# Altium schematic sheet LedMatrix_TestWithSingleDigit.SchDoc
size A4; Organization: Altium Limited; Address1: L3, 12a Rodborough Rd; Address2: Frenchs Forest; Address3: NSW; Address4: Australia 2086
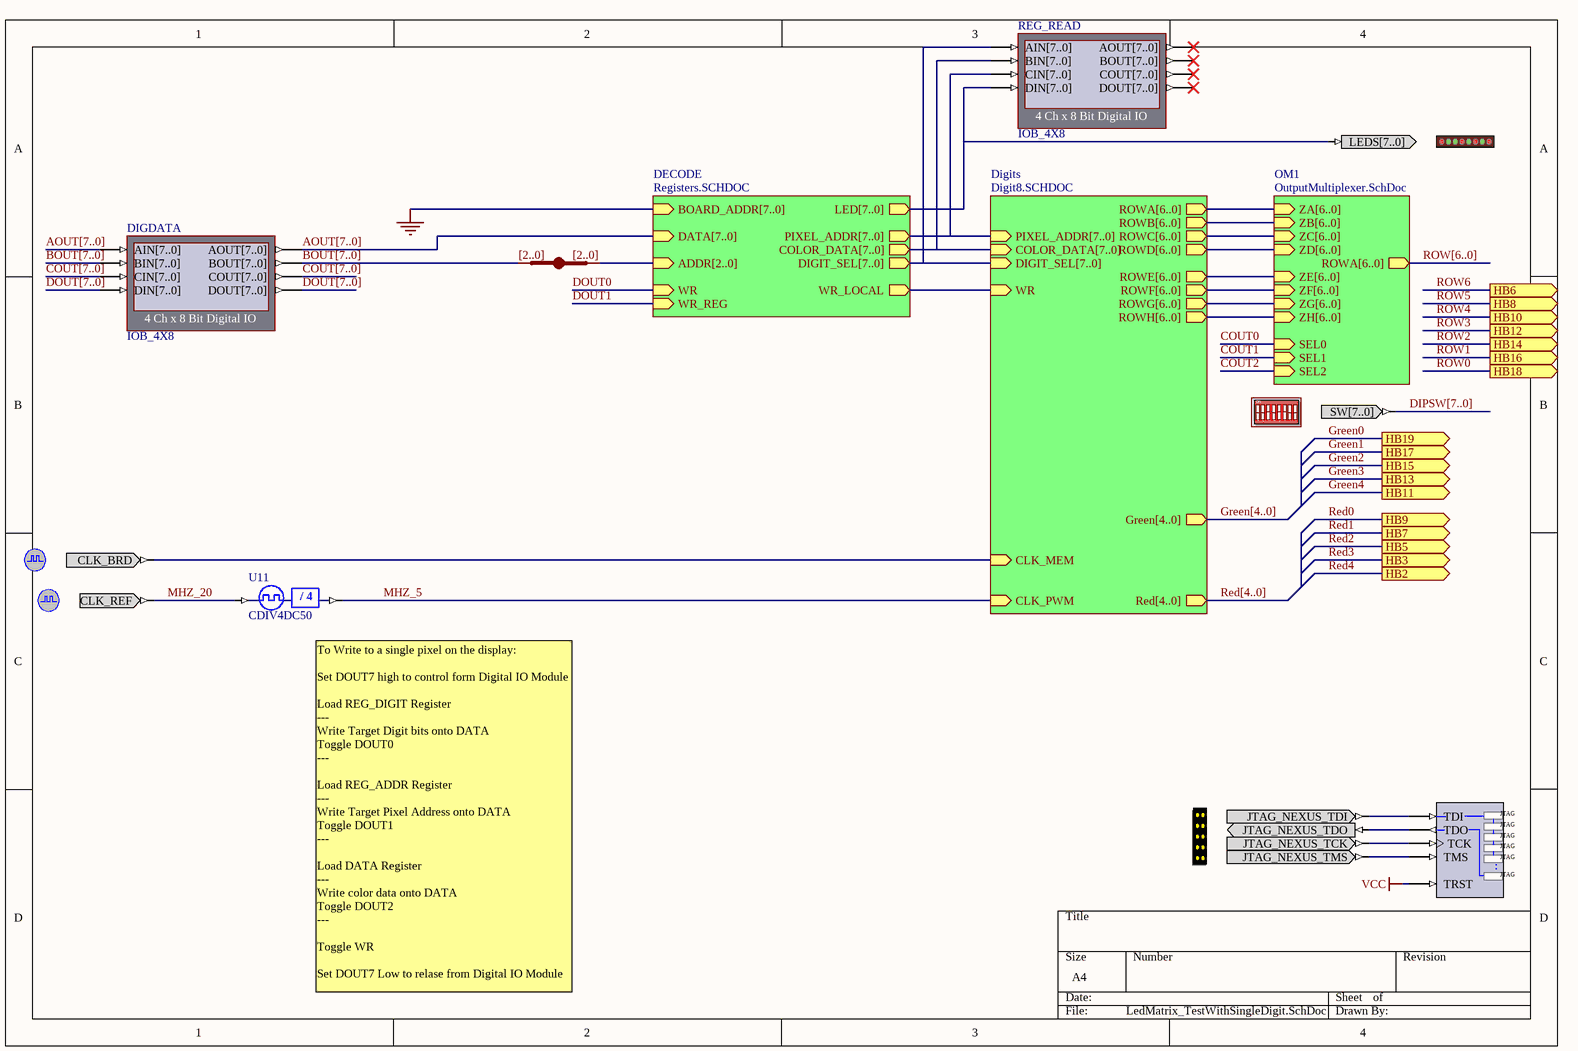
[diagram p0: LedMatrix_TestWithSingleDigit.SchDoc]

## Parts
(Parts that share a designator on the sheet are numbered #1, #2 ... from top to bottom, then left to right.)
?#1  LED  (value not drawn)
?#2  DIPSWITCH  (value not drawn)
?#3  CLOCK_BOARD  (value not drawn)
?#4  CLOCK_REFERENCE  (value not drawn)
?#5  NEXUS_JTAG_CONNECTOR  (value not drawn)
DIGDATA  IOB_4X8
JB_AUTO?  IndexA: [2..0]  (hidden comment: JB)
NEXUS_JTAG_PORT  NEXUS_JTAG_PORT  (value not drawn)
REG_READ  IOB_4X8
U11  CDIV4DC50

## Sub-sheets
DECODE = Registers.SCHDOC: WR (in), ADDR[2..0] (in), BOARD_ADDR[7..0] (in), PIXEL_ADDR[7..0] (out), DATA[7..0] (in), COLOR_DATA[7..0] (out), DIGIT_SEL[7..0] (out), WR_LOCAL (out), LED[7..0] (out), WR_REG (in)
Digits = Digit8.SCHDOC: ROWB[6..0] (out), ROWC[6..0] (out), ROWD[6..0] (out), ROWF[6..0] (out), ROWG[6..0] (out), ROWH[6..0] (out), ROWE[6..0] (out), ROWA[6..0] (out), CLK_MEM (in), CLK_PWM (in), Red[4..0] (out), Green[4..0] (out), PIXEL_ADDR[7..0] (in), COLOR_DATA[7..0] (in), DIGIT_SEL[7..0] (in), WR (in)
OM1 = OutputMultiplexer.SchDoc: ROWA[6..0] (out), SEL0 (in), SEL1 (in), SEL2 (in), ZB[6..0] (in), ZC[6..0] (in), ZD[6..0] (in), ZF[6..0] (in), ZG[6..0] (in), ZH[6..0] (in), ZE[6..0] (in), ZA[6..0] (in)

## Ports
HB2 (out), HB3 (out), HB5 (out), HB6 (out), HB7 (out), HB8 (out), HB9 (out), HB10 (out), HB11 (out), HB12 (out), HB13 (out), HB14 (out), HB15 (out), HB16 (out), HB17 (out), HB18 (out), HB19 (out)

## Nets
VCC: NEXUS_JTAG_PORT.TRST
AOUT[7..0]: DIGDATA.AIN[7..0] DIGDATA.AOUT[7..0] ; sheet DECODE/DATA[7..0]
BOUT[7..0]: DIGDATA.BIN[7..0] DIGDATA.BOUT[7..0] JB_AUTO?.A[0..0]
COUT0: sheet OM1/SEL0
COUT1: sheet OM1/SEL1
COUT2: sheet OM1/SEL2
COUT[7..0]: DIGDATA.CIN[7..0] DIGDATA.COUT[7..0]
DIPSW[7..0]: ?#2.SW[7..0]
DOUT0: sheet DECODE/WR
DOUT1: sheet DECODE/WR_REG
DOUT[7..0]: DIGDATA.DIN[7..0] DIGDATA.DOUT[7..0]
Green0: port HB19
Green1: port HB17
Green2: port HB15
Green3: port HB13
Green4: port HB11
MHZ_5: U11.CLKDV ; sheet Digits/CLK_PWM
MHZ_20: ?#4.CLK_REF U11.CLKIN
Red0: port HB9
Red1: port HB7
Red2: port HB5
Red3: port HB3
Red4: port HB2
ROW0: port HB18
ROW1: port HB16
ROW2: port HB14
ROW3: port HB12
ROW4: port HB10
ROW5: port HB8
ROW6: port HB6
Net?#1_LEDS[7..0]: ?#1.LEDS[7..0] REG_READ.DIN[7..0] ; sheet DECODE/LED[7..0]
Net?#3_CLK_BRD: ?#3.CLK_BRD ; sheet Digits/CLK_MEM
Net?#5_JTAG_NEXUS_TCK: ?#5.JTAG_NEXUS_TCK NEXUS_JTAG_PORT.TCK
Net?#5_JTAG_NEXUS_TDI: ?#5.JTAG_NEXUS_TDI NEXUS_JTAG_PORT.TDI
Net?#5_JTAG_NEXUS_TDO: ?#5.JTAG_NEXUS_TDO NEXUS_JTAG_PORT.TDO
Net?#5_JTAG_NEXUS_TMS: ?#5.JTAG_NEXUS_TMS NEXUS_JTAG_PORT.TMS
NetJB_AUTO?_B[0..0]: JB_AUTO?.B[0..0] ; sheet DECODE/ADDR[2..0]
NetREG_READ_AIN[7..0]: REG_READ.AIN[7..0] ; sheet Digits/DIGIT_SEL[7..0], sheet DECODE/DIGIT_SEL[7..0]
NetREG_READ_BIN[7..0]: REG_READ.BIN[7..0] ; sheet Digits/COLOR_DATA[7..0], sheet DECODE/COLOR_DATA[7..0]
NetREG_READ_CIN[7..0]: REG_READ.CIN[7..0] ; sheet Digits/PIXEL_ADDR[7..0], sheet DECODE/PIXEL_ADDR[7..0]
(unnamed): sheet Digits/WR, sheet DECODE/WR_LOCAL

Not connected (* = marked no-connect by the designer): REG_READ AOUT[7..0]* BOUT[7..0]* COUT[7..0]* DOUT[7..0]*

## Buses and harness runs
bus AOUT[7..0]
bus AOUT[7..0] = sheet DECODE/DATA[7..0]
bus BOUT[7..0]
bus COUT[7..0]
bus DIPSW[7..0]
bus DOUT[7..0]
bus Green[4..0] = sheet Digits/Green[4..0]
bus Red[4..0] = sheet Digits/Red[4..0]
bus ROW[6..0] = sheet OM1/ROWA[6..0]
bus sheet DECODE/COLOR_DATA[7..0] = sheet Digits/COLOR_DATA[7..0]
bus sheet DECODE/DIGIT_SEL[7..0] = sheet Digits/DIGIT_SEL[7..0]
bus sheet DECODE/PIXEL_ADDR[7..0] = sheet Digits/PIXEL_ADDR[7..0]
bus sheet Digits/ROWA[6..0] = sheet OM1/ZA[6..0]
bus sheet Digits/ROWB[6..0] = sheet OM1/ZB[6..0]
bus sheet Digits/ROWC[6..0] = sheet OM1/ZC[6..0]
bus sheet Digits/ROWD[6..0] = sheet OM1/ZD[6..0]
bus sheet Digits/ROWE[6..0] = sheet OM1/ZE[6..0]
bus sheet Digits/ROWF[6..0] = sheet OM1/ZF[6..0]
bus sheet Digits/ROWG[6..0] = sheet OM1/ZG[6..0]
bus sheet Digits/ROWH[6..0] = sheet OM1/ZH[6..0]

## Notes on the sheet
- (near U11) To Write to a single pixel on the display:
  Set DOUT7 high to control form Digital IO Module
  Load REG_DIGIT Register
  ---
  Write Target Digit bits onto DATA
  Toggle DOUT0
  ---
  Load REG_ADDR Register
  ---
  Write Target Pixel Address onto DATA
  Toggle DOUT1
  ---
  Load DATA Register
  ---
  Write color data onto DATA
  Toggle DOUT2
  ---
  Toggle WR
  Set DOUT7 Low to relase from Digital IO Module
- Title
- Size:
- Date:
- A4
- Number:
- Time:
- Revision:
- Sheet
- of
- File:
- (in symbol CDIV4DC50) / 4
- (in symbol DIPSWITCH) ON; 1; 2; 3; 4; 5; 6; 7; 8
- (in symbol NEXUS_JTAG_PORT) JTAG; .

## Library data of the parts
?#1 = LED: 8-Way LEDS; PortComponent: True; Published: 19-Nov-2003; Publisher: Altium Limited
?#2 = DIPSWITCH: 8-Way Dip Switch; PortComponent: True; Published: 19-Nov-2003; Publisher: Altium Limited
?#3 = CLOCK_BOARD: Global System Clock Supply; PortComponent: True; Published: 19-Nov-2003; Publisher: Altium Limited
?#4 = CLOCK_REFERENCE: Global System Clock Reference Supply; PortComponent: True; Published: 19-Nov-2003; Publisher: Altium Limited
?#5 = NEXUS_JTAG_CONNECTOR: JTAG Port; PortComponent: True; Published: 19-Nov-2003; Publisher: Altium Limited
DIGDATA REG_READ = IOB_4X8: 4 Ch x 8 Bit Digital IO; NEXUS_CORE: Instrument; NEXUS_JTAG_DEVICE: True; NEXUS_JTAG_ORDER: 0; Published: 30/09/2003; Publisher: Altium Hobart Technology Centre; Core Revision: 1.00.00
JB_AUTO? = JB: System BUS Joiner; ArchiveName: GENERIC; Published: 18-Dec-2003; Publisher: Altium Limited; Core Revision: 1.00.00; IndexB: [2..0]
NEXUS_JTAG_PORT = NEXUS_JTAG_PORT: Soft Nexus-Chain Connector; NEXUS_JTAG_CONNECTOR: True; Published: 18-Dec-2003; Publisher: Altium Limited
U11 = CDIV4DC50: Clock Divider by 4 with 50% Duty Cycle Output; ArchiveName: GENERIC; Xilinx Equivalent: CLK_DIV4; Published: 18-Dec-2003; Publisher: Altium Limited; Core Revision: 1.00.00